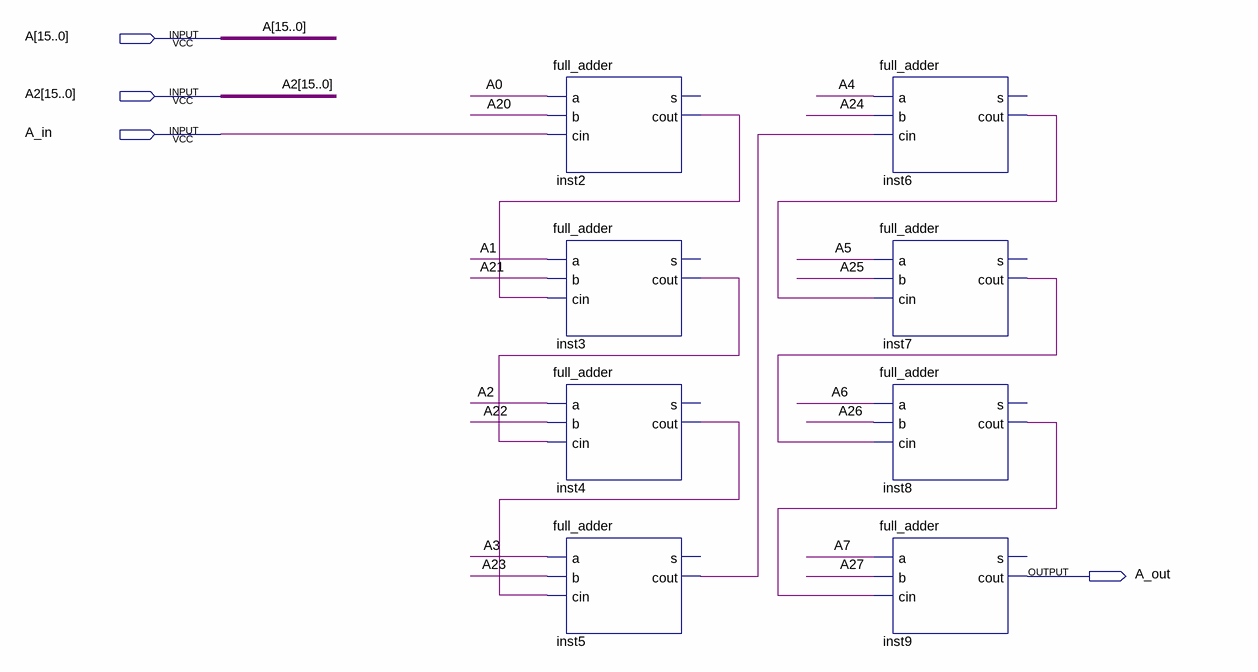
[diagram p0: schematic sheet]
// Quartus schematic Delay.bdf as structural Verilog: 8 symbols, 4 pins
module Delay (
  input  [15:0] A,
  input  [15:0] A2,
  input  A_in,
  output A_out
);

  wire inst2_cout, inst3_cout, inst4_cout, inst5_cout, inst6_cout, inst7_cout, inst8_cout;

  full_adder inst2 (.a(A[0]), .b(A2[0]), .cin(A_in), .cout(inst2_cout));  // open: s
  full_adder inst3 (.a(A[1]), .b(A2[1]), .cin(inst2_cout), .cout(inst3_cout));  // open: s
  full_adder inst4 (.a(A[2]), .b(A2[2]), .cin(inst3_cout), .cout(inst4_cout));  // open: s
  full_adder inst5 (.a(A[3]), .b(A2[3]), .cin(inst4_cout), .cout(inst5_cout));  // open: s
  full_adder inst6 (.a(A[4]), .b(A2[4]), .cin(inst5_cout), .cout(inst6_cout));  // open: s
  full_adder inst7 (.a(A[5]), .b(A2[5]), .cin(inst6_cout), .cout(inst7_cout));  // open: s
  full_adder inst8 (.a(A[6]), .b(A2[6]), .cin(inst7_cout), .cout(inst8_cout));  // open: s
  full_adder inst9 (.a(A[7]), .b(A2[7]), .cin(inst8_cout), .cout(A_out));  // open: s
endmodule
